# EAGLE design DotMatrixDigitalClockDisplay (EAGLE 9.6.1)
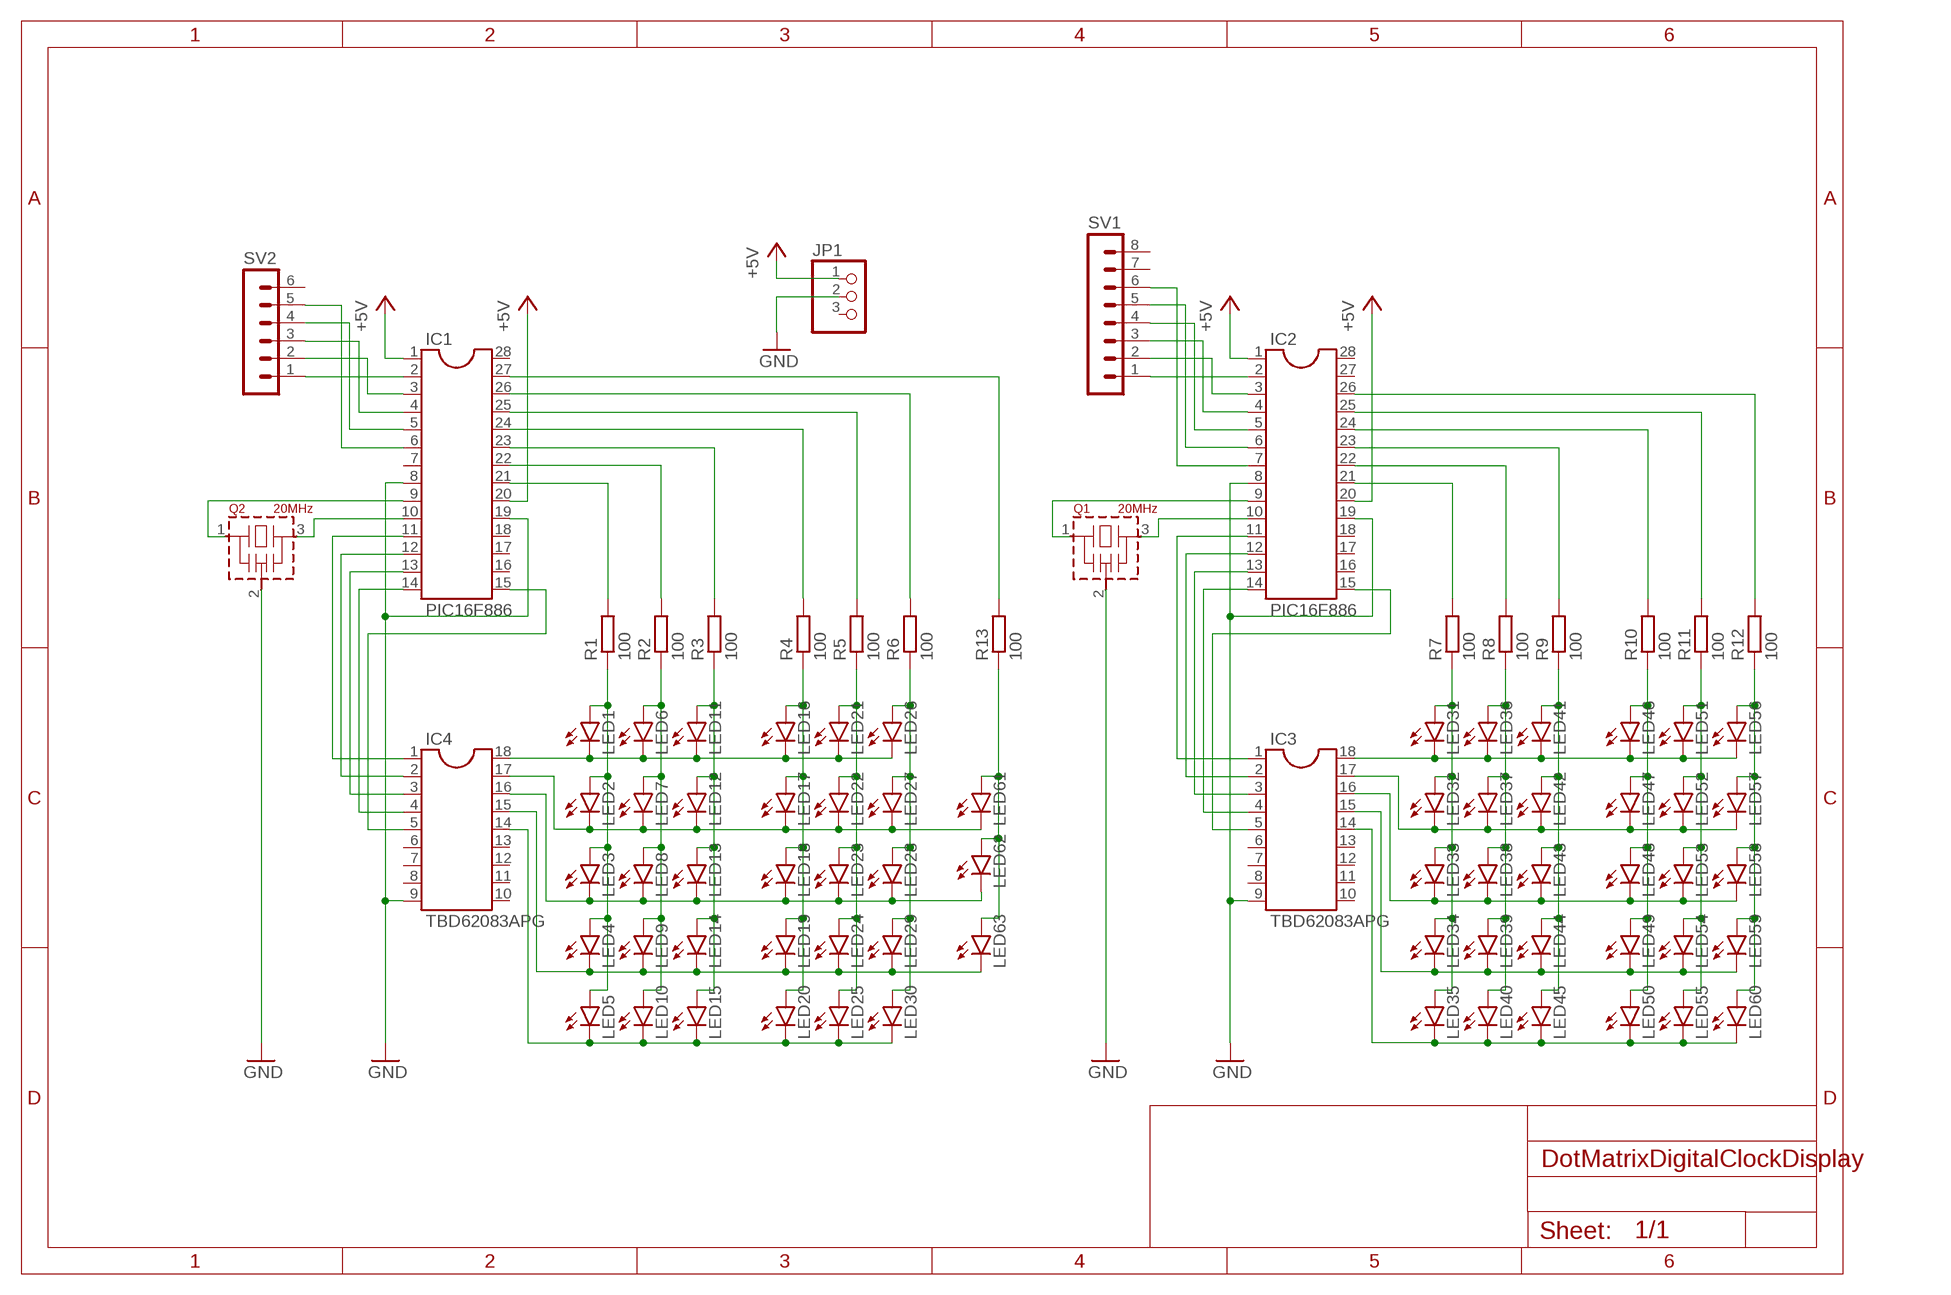
[diagram p0: schematic, sheet 1]

## Parts
IC1  PIC16F886  DIL28-3  [DIL28-3]
IC2  PIC16F886  DIL28-3  [DIL28-3]
IC3  TBD62083APG  DIL18  [DIL18]
IC4  TBD62083APG  DIL18  [DIL18]
JP1  PINHD-1X3  [1X03]
LED1  LED5MM  [LED5MM]
LED2  LED5MM  [LED5MM]
LED3  LED5MM  [LED5MM]
LED4  LED5MM  [LED5MM]
LED5  LED5MM  [LED5MM]
LED6  LED5MM  [LED5MM]
LED7  LED5MM  [LED5MM]
LED8  LED5MM  [LED5MM]
LED9  LED5MM  [LED5MM]
LED10  LED5MM  [LED5MM]
LED11  LED5MM  [LED5MM]
LED12  LED5MM  [LED5MM]
LED13  LED5MM  [LED5MM]
LED14  LED5MM  [LED5MM]
LED15  LED5MM  [LED5MM]
LED16  LED5MM  [LED5MM]
LED17  LED5MM  [LED5MM]
LED18  LED5MM  [LED5MM]
LED19  LED5MM  [LED5MM]
LED20  LED5MM  [LED5MM]
LED21  LED5MM  [LED5MM]
LED22  LED5MM  [LED5MM]
LED23  LED5MM  [LED5MM]
LED24  LED5MM  [LED5MM]
LED25  LED5MM  [LED5MM]
LED26  LED5MM  [LED5MM]
LED27  LED5MM  [LED5MM]
LED28  LED5MM  [LED5MM]
LED29  LED5MM  [LED5MM]
LED30  LED5MM  [LED5MM]
LED31  LED5MM  [LED5MM]
LED32  LED5MM  [LED5MM]
LED33  LED5MM  [LED5MM]
LED34  LED5MM  [LED5MM]
LED35  LED5MM  [LED5MM]
LED36  LED5MM  [LED5MM]
LED37  LED5MM  [LED5MM]
LED38  LED5MM  [LED5MM]
LED39  LED5MM  [LED5MM]
LED40  LED5MM  [LED5MM]
LED41  LED5MM  [LED5MM]
LED42  LED5MM  [LED5MM]
LED43  LED5MM  [LED5MM]
LED44  LED5MM  [LED5MM]
LED45  LED5MM  [LED5MM]
LED46  LED5MM  [LED5MM]
LED47  LED5MM  [LED5MM]
LED48  LED5MM  [LED5MM]
LED49  LED5MM  [LED5MM]
LED50  LED5MM  [LED5MM]
LED51  LED5MM  [LED5MM]
LED52  LED5MM  [LED5MM]
LED53  LED5MM  [LED5MM]
LED54  LED5MM  [LED5MM]
LED55  LED5MM  [LED5MM]
LED56  LED5MM  [LED5MM]
LED57  LED5MM  [LED5MM]
LED58  LED5MM  [LED5MM]
LED59  LED5MM  [LED5MM]
LED60  LED5MM  [LED5MM]
LED61  LED5MM  [LED5MM]
LED62  LED5MM  [LED5MM]
LED63  LED5MM  [LED5MM]
Q1  20MHz  CSTLS_X  [CSTLS_X]
Q2  20MHz  CSTLS_X  [CSTLS_X]
R1  100  R-EU_0207/7  [0207/7]
R2  100  R-EU_0207/7  [0207/7]
R3  100  R-EU_0207/7  [0207/7]
R4  100  R-EU_0207/7  [0207/7]
R5  100  R-EU_0207/7  [0207/7]
R6  100  R-EU_0207/7  [0207/7]
R7  100  R-EU_0207/7  [0207/7]
R8  100  R-EU_0207/7  [0207/7]
R9  100  R-EU_0207/7  [0207/7]
R10  100  R-EU_0207/7  [0207/7]
R11  100  R-EU_0207/7  [0207/7]
R12  100  R-EU_0207/7  [0207/7]
R13  100  R-EU_0207/7  [0207/7]
SV1  MA08-1  [MA08-1]
SV2  MA06-1  [MA06-1]

## Nets
+5V: IC1.1 IC1.20 IC2.1 IC2.20 JP1.1
GND: IC1.8 IC1.19 IC2.8 IC2.19 IC3.9 IC4.9 JP1.2 Q1.2(VSS) Q2.2(VSS)
N$1: LED1.A LED2.A LED3.A LED4.A LED5.A R1.1
N$2: LED6.A LED7.A LED8.A LED9.A LED10.A R2.1
N$3: LED11.A LED12.A LED13.A LED14.A LED15.A R3.1
N$4: LED16.A LED17.A LED18.A LED19.A LED20.A R4.1
N$5: LED21.A LED22.A LED23.A LED24.A LED25.A R5.1
N$6: LED26.A LED27.A LED28.A LED29.A LED30.A R6.1
N$7: LED31.A LED32.A LED33.A LED34.A LED35.A R7.1
N$8: LED36.A LED37.A LED38.A LED39.A LED40.A R8.1
N$9: LED41.A LED42.A LED43.A LED44.A LED45.A R9.1
N$10: LED46.A LED47.A LED48.A LED49.A LED50.A R10.1
N$11: LED51.A LED52.A LED53.A LED54.A LED55.A R11.1
N$12: LED56.A LED57.A LED58.A LED59.A LED60.A R12.1
N$13: LED61.A LED62.A LED63.A R13.1
N$14: IC4.18 LED1.K(C) LED6.K(C) LED11.K(C) LED16.K(C) LED21.K(C) LED26.K(C)
N$15: IC4.17 LED2.K(C) LED7.K(C) LED12.K(C) LED17.K(C) LED22.K(C) LED27.K(C) LED61.K(C)
N$16: IC4.16 LED3.K(C) LED8.K(C) LED13.K(C) LED18.K(C) LED23.K(C) LED28.K(C) LED62.K(C)
N$17: IC4.15 LED4.K(C) LED9.K(C) LED14.K(C) LED19.K(C) LED24.K(C) LED29.K(C) LED63.K(C)
N$18: IC4.14 LED5.K(C) LED10.K(C) LED15.K(C) LED20.K(C) LED25.K(C) LED30.K(C)
N$19: IC3.18 LED31.K(C) LED36.K(C) LED41.K(C) LED46.K(C) LED51.K(C) LED56.K(C)
N$20: IC3.17 LED32.K(C) LED37.K(C) LED42.K(C) LED47.K(C) LED52.K(C) LED57.K(C)
N$21: IC3.16 LED33.K(C) LED38.K(C) LED43.K(C) LED48.K(C) LED53.K(C) LED58.K(C)
N$22: IC3.15 LED34.K(C) LED39.K(C) LED44.K(C) LED49.K(C) LED54.K(C) LED59.K(C)
N$23: IC3.14 LED35.K(C) LED40.K(C) LED45.K(C) LED50.K(C) LED55.K(C) LED60.K(C)
N$24: IC2.14 IC3.4
N$25: IC2.13 IC3.3
N$26: IC2.12 IC3.2
N$27: IC2.11 IC3.1
N$28: IC2.9 Q1.1
N$29: IC2.21 R7.2
N$30: IC2.22 R8.2
N$31: IC2.23 R9.2
N$32: IC2.24 R10.2
N$33: IC2.25 R11.2
N$34: IC2.26 R12.2
N$35: IC2.10 Q1.3
N$36: IC2.15 IC3.5
N$37: IC1.14 IC4.4
N$38: IC1.15 IC4.5
N$39: IC1.13 IC4.3
N$40: IC1.12 IC4.2
N$41: IC1.11 IC4.1
N$42: IC1.21 R1.2
N$43: IC1.22 R2.2
N$44: IC1.23 R3.2
N$45: IC1.24 R4.2
N$46: IC1.25 R5.2
N$47: IC1.26 R6.2
N$48: IC1.27 R13.2
N$49: IC1.10 Q2.3
N$50: IC1.9 Q2.1
N$51: IC1.2 SV2.1
N$52: IC1.3 SV2.2
N$53: IC1.4 SV2.3
N$54: IC1.5 SV2.4
N$55: IC1.6 SV2.5
N$56: IC2.2 SV1.1
N$57: IC2.3 SV1.2
N$58: IC2.4 SV1.3
N$59: IC2.5 SV1.4
N$60: IC2.6 SV1.5
N$61: IC2.7 SV1.6
Unconnected: IC1.7 IC1.16 IC1.17 IC1.18 IC1.28 IC2.16 IC2.17 IC2.18 IC2.27 IC2.28 IC3.6 IC3.7 IC3.8 IC3.10 IC3.11 IC3.12 IC3.13 IC4.6 IC4.7 IC4.8 IC4.10 IC4.11 IC4.12 IC4.13 JP1.3 SV1.7 SV1.8 SV2.6

## Library data of the parts
IC1 IC2 = ic-package:DIL28: Dual In Line
IC3 IC4 = ic-package:DIL18: Dual In Line / Socket
JP1 = pinhead:PINHD-1X3: PIN HEADER
LED1-LED63 = led:LED: LED OSRAM: - CHIPLED LG R971, LG N971, LY N971, LG Q971, LY Q971, LO R971, LY R971 LH N974, LH R974 LS Q976, LO Q976, LY Q976 LO Q996 - Hyper CHIPLED LW Q18S LB Q993, LB Q99A, LB R99A - SideLED LS A670, LO A670, LY A670, LG A670, LP A670 LB A673, LV A673, LT A673, LW A673 LH A674 LY A675 LS A676, LA A676, LO A676, LY A676, LW A676 LS A679, LY A679, LG A679 - Hyper Micro SIDELED® LS Y876, LA Y876, LO Y876, LY Y876 LT Y87S - SmartLED LW L88C, LW L88S LB L89C, LB L89S, LG L890 LS L89K, LO L89K, LY L89K LS L896, LA L896, LO L896, LY L896 - TOPLED LS T670, LO T670, LY T670, LG T670, LP T670 LSG T670, LSP T670, LSY T670, LOP T670, LYG T670 LG T671, LOG T671, LSG T671 LB T673, LV T673, LT T673, LW T673 LH T674 LS T676, LA T676, LO T676, LY T676, LB T676, LH T676, LSB T676, LW T676 LB T67C, LV T67C, LT T67C, LS T67K, LO T67K, LY T67K, LW E67C LS E67B, LA E67B, LO E67B, LY E67B, LB E67C, LV E67C, LT E67C LW T67C LS T679, LY T679, LG T679 LS T770, LO T770, LY T770, LG T770, LP T770 LB T773, LV T773, LT T773, LW T773 LH T774 LS E675, LA E675, LY E675, LS T675 LS T776, LA T776, LO T776, LY T776, LB T776 LHGB T686 LT T68C, LB T68C - Hyper Mini TOPLED® LB M676 - Mini TOPLED Santana® LG M470 LS M47K, LO M47K, LY M47K Source: http://www.osram.convergy.de LUXEON: - LUMILED® LXK2-PW12-R00, LXK2-PW12-S00, LXK2-PW14-U00, LXK2-PW14-V00 LXK2-PM12-R00, LXK2-PM12-S00, LXK2-PM14-U00 LXK2-PE12-Q00, LXK2-PE12-R00, LXK2-PE12-S00, LXK2-PE14-T00, LXK2-PE14-U00 LXK2-PB12-K00, LXK2-PB12-L00, LXK2-PB12-M00, LXK2-PB14-N00, LXK2-PB14-P00, LXK2-PB14-Q00 LXK2-PR12-L00, LXK2-PR12-M00, LXK2-PR14-Q00, LXK2-PR14-R00 LXK2-PD12-Q00, LXK2-PD12-R00, LXK2-PD12-S00 LXK2-PH12-R00, LXK2-PH12-S00 LXK2-PL12-P00, LXK2-PL12-Q00, LXK2-PL12-R00 Source: www.luxeon.com KINGBRIGHT: KA-3528ASYC Source: www.kingbright.com
Q1 Q2 = murata-resonators:CSTLS_X: Ceramic resonator 16.00 to 70.00 MHz
R1-R13 = rcl:R-EU_: RESISTOR, European symbol; SPICEPREFIX: R
SV1 = con-lstb:MA08-1: PIN HEADER; OC_FARNELL: unknown; OC_NEWARK: unknown
SV2 = con-lstb:MA06-1: PIN HEADER; OC_FARNELL: unknown; OC_NEWARK: unknown

## Board
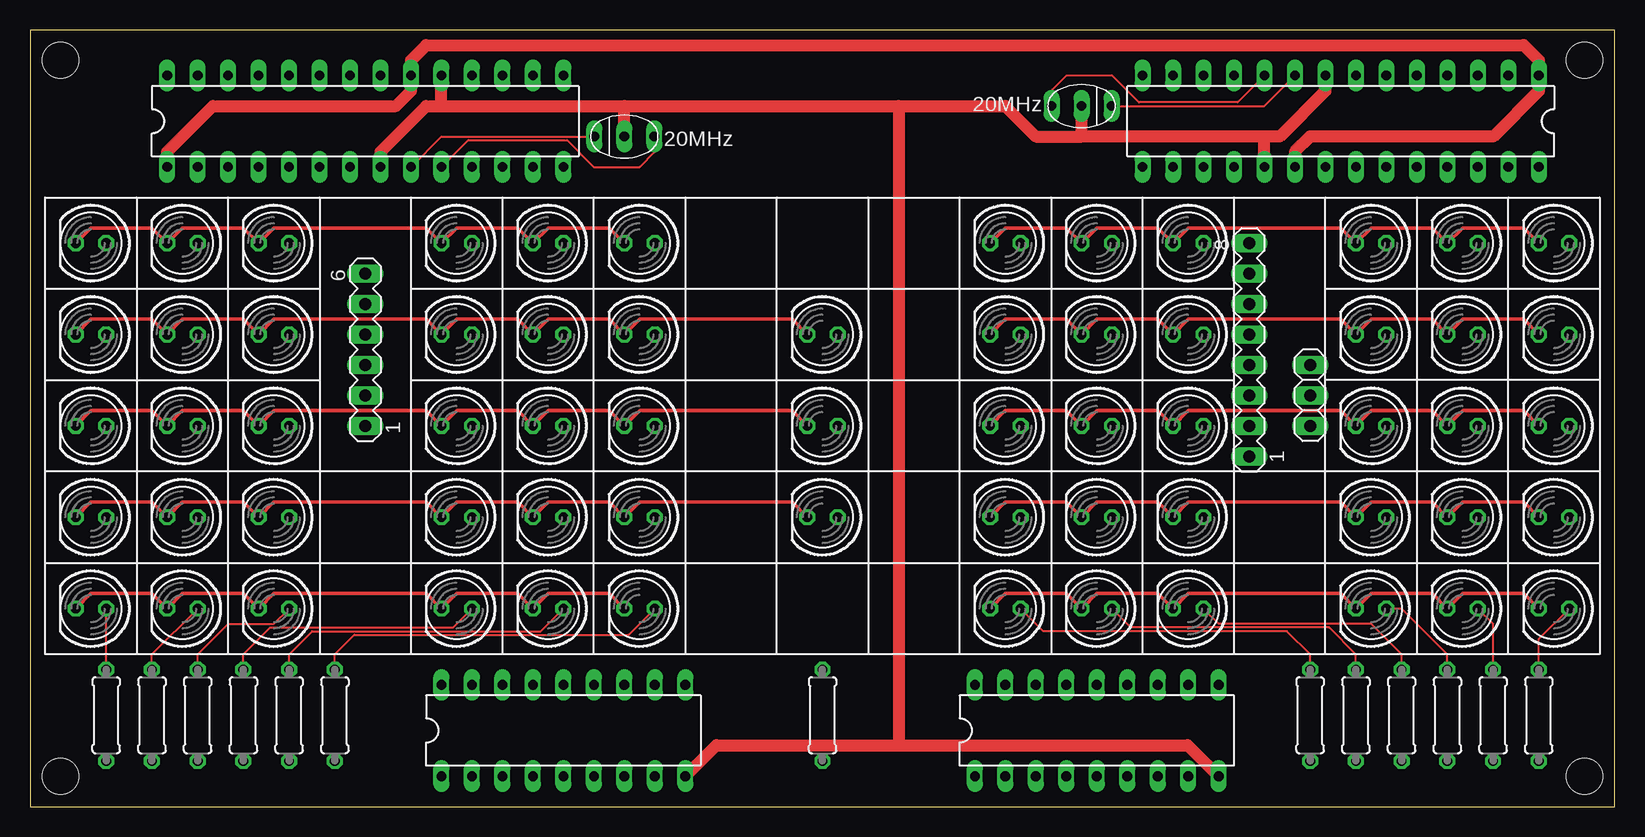
[diagram p1: board, top side]
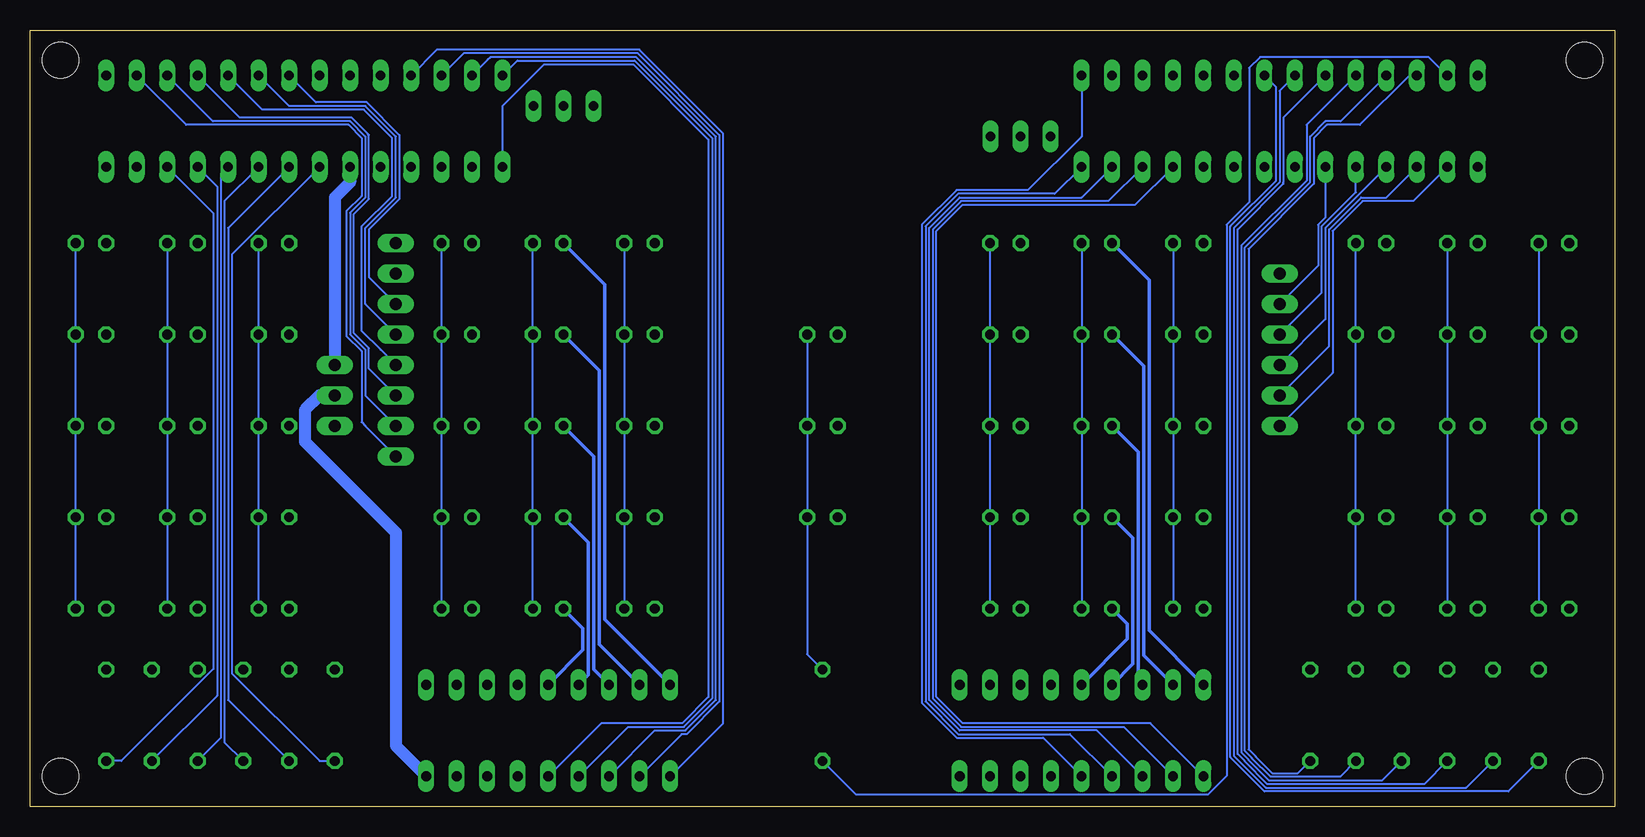
[diagram p2: board, bottom side, seen from below]

Size 132.08 x 64.76 mm. Coordinates in mm from the lower left corner, seen from the top.
Outline: 0,0 132.08,0 132.08,64.76 0,64.76 0,0
Copper layers (1*16): Top 0.035mm / dielectric 1.5mm / Bottom 0.035mm
Design rules "SeeedStudio_2layer_DRU_no_angle_20140221": minimum track width 6mil, minimum drill 12mil, track to track 6mil, track to pad 6mil, pad to pad 6mil, via to via 6mil, smd to smd 0mil, copper to edge 10mil, drill to drill 10mil, minimum pad ring 10mil, minimum via ring 6mil, stop-mask expansion 2mil, vias tented up to drill 100mil, thermal gap 10mil
Holes 3 mm at 2.54,2.54 129.54,2.54 2.54,62.23 129.54,62.23

### Footprints (pad centres in the part's own frame; a part is rotated, then mirrored left to right if it is on the bottom)
DIL28-3 = drill 0.813 long: 1 -16.51,-3.81; 2 -13.97,-3.81; 3 -11.43,-3.81; 4 -8.89,-3.81; 5 -6.35,-3.81; 6 -3.81,-3.81; 7 -1.27,-3.81; 8 1.27,-3.81; 9 3.81,-3.81; 10 6.35,-3.81; 11 8.89,-3.81; 12 11.43,-3.81; 13 13.97,-3.81; 14 16.51,-3.81; 15 16.51,3.81; 16 13.97,3.81; 17 11.43,3.81; 18 8.89,3.81; 19 6.35,3.81; 20 3.81,3.81; 21 1.27,3.81; 22 -1.27,3.81; 23 -3.81,3.81; 24 -6.35,3.81; 25 -8.89,3.81; 26 -11.43,3.81; 27 -13.97,3.81; 28 -16.51,3.81
DIL18 = drill 0.813 long: 1 -10.16,-3.81; 2 -7.62,-3.81; 3 -5.08,-3.81; 4 -2.54,-3.81; 5 0,-3.81; 6 2.54,-3.81; 7 5.08,-3.81; 8 7.62,-3.81; 9 10.16,-3.81; 10 10.16,3.81; 11 7.62,3.81; 12 5.08,3.81; 13 2.54,3.81; 14 0,3.81; 15 -2.54,3.81; 16 -5.08,3.81; 17 -7.62,3.81; 18 -10.16,3.81
1X03 = drill 1.016 long: 1 -2.54,0; 2 0,0; 3 2.54,0
LED5MM = drill 0.813 octagon: A -1.27,0; K 1.27,0
CSTLS_X = drill 0.813 long: 1 -2.5,0; 2 0,0; 3 2.5,0
0207/7 = drill 0.813 octagon: 1 -3.81,0; 2 3.81,0
MA08-1 = drill 1.016 long: 1 -8.89,0; 2 -6.35,0; 3 -3.81,0; 4 -1.27,0; 5 1.27,0; 6 3.81,0; 7 6.35,0; 8 8.89,0
MA06-1 = drill 1.016 long: 1 -6.35,0; 2 -3.81,0; 3 -1.27,0; 4 1.27,0; 5 3.81,0; 6 6.35,0

### Placement (x,y rotation side)
IC1  27.94,57.15 0 top
IC2  109.22,57.15 180 top
IC3  88.9,6.35 0 top
IC4  44.45,6.35 0 top
JP1  106.68,34.29 270 top
LED1  5.08,46.99 180 top
LED2  5.08,39.37 180 top
LED3  5.08,31.75 180 top
LED4  5.08,24.13 180 top
LED5  5.08,16.51 180 top
LED6  12.7,46.99 180 top
LED7  12.7,39.37 180 top
LED8  12.7,31.75 180 top
LED9  12.7,24.13 180 top
LED10  12.7,16.51 180 top
LED11  20.32,46.99 180 top
LED12  20.32,39.37 180 top
LED13  20.32,31.75 180 top
LED14  20.32,24.13 180 top
LED15  20.32,16.51 180 top
LED16  35.56,46.99 180 top
LED17  35.56,39.37 180 top
LED18  35.56,31.75 180 top
LED19  35.56,24.13 180 top
LED20  35.56,16.51 180 top
LED21  43.18,46.99 180 top
LED22  43.18,39.37 180 top
LED23  43.18,31.75 180 top
LED24  43.18,24.13 180 top
LED25  43.18,16.51 180 top
LED26  50.8,46.99 180 top
LED27  50.8,39.37 180 top
LED28  50.8,31.75 180 top
LED29  50.8,24.13 180 top
LED30  50.8,16.51 180 top
LED31  81.28,46.99 180 top
LED32  81.28,39.37 180 top
LED33  81.28,31.75 180 top
LED34  81.28,24.13 180 top
LED35  81.28,16.51 180 top
LED36  88.9,46.99 180 top
LED37  88.9,39.37 180 top
LED38  88.9,31.75 180 top
LED39  88.9,24.13 180 top
LED40  88.9,16.51 180 top
LED41  96.52,46.99 180 top
LED42  96.52,39.37 180 top
LED43  96.52,31.75 180 top
LED44  96.52,24.13 180 top
LED45  96.52,16.51 180 top
LED46  111.76,46.99 180 top
LED47  111.76,39.37 180 top
LED48  111.76,31.75 180 top
LED49  111.76,24.13 180 top
LED50  111.76,16.51 180 top
LED51  119.38,46.99 180 top
LED52  119.38,39.37 180 top
LED53  119.38,31.75 180 top
LED54  119.38,24.13 180 top
LED55  119.38,16.51 180 top
LED56  127,46.99 180 top
LED57  127,39.37 180 top
LED58  127,31.75 180 top
LED59  127,24.13 180 top
LED60  127,16.51 180 top
LED61  66.04,39.37 180 top
LED62  66.04,31.75 180 top
LED63  66.04,24.13 180 top
Q1  87.63,58.42 180 top
Q2  49.53,55.88 0 top
R1  6.35,7.62 270 top
R2  10.16,7.62 270 top
R3  13.97,7.62 270 top
R4  17.78,7.62 270 top
R5  21.59,7.62 270 top
R6  25.4,7.62 270 top
R7  106.68,7.62 270 top
R8  110.49,7.62 270 top
R9  114.3,7.62 270 top
R10  118.11,7.62 270 top
R11  121.92,7.62 270 top
R12  125.73,7.62 270 top
R13  66.04,7.62 270 top
SV1  101.6,38.1 90 top
SV2  27.94,38.1 90 top

### Tracks (layer width: path | path; a pad name or v marks a point on that pad's centre or on a via)
+5V
  Top 1.016: IC1.1 11.43,54.61 15.24,58.42 30.48,58.42 31.75,59.69 IC1.20 31.75,62.23 33.02,63.5 124.46,63.5 125.73,62.23 IC2.1 125.73,59.69 121.92,55.88 106.68,55.88 105.41,54.61 IC2.20
  Bottom 1.016: IC2.20 105.41,52.07 106.68,50.8 JP1.1
GND
  Top 1.016: 34.29,58.42 IC1.19 | 72.39,5.13 57.2,5.13 IC4.9 | 72.39,5.13 96.47,5.13 IC3.9 | 34.29,58.42 49.53,58.42 | Q2.2 49.53,58.42 | IC2.19 102.87,55.88 | 102.87,55.88 87.63,55.88 | 87.63,55.88 Q1.2 | 49.53,58.42 72.39,58.42 | 72.39,58.42 81.28,58.42 83.82,55.88 87.63,55.88 | IC1.8 29.21,54.61 33.02,58.42 34.29,58.42 | IC2.8 107.95,59.69 104.14,55.88 102.87,55.88 | 72.39,58.42 72.39,5.13
  Bottom 1.016: JP1.2 107.95,34.29 109.17,33.07 109.17,30.43 101.6,22.86 101.6,5.08 IC3.9
N$1
  Top 0.152: R1.1 LED5.A
  Bottom 0.152: LED1.A LED2.A LED3.A LED4.A LED5.A
N$2
  Top 0.152: R2.1 10.16,12.7 LED10.A
  Bottom 0.152: LED6.A LED7.A LED8.A LED9.A LED10.A
N$3
  Top 0.152: R3.1 13.97,12.7 16.51,15.24 20.32,15.24 LED15.A
  Bottom 0.152: LED15.A LED14.A LED13.A LED12.A LED11.A
N$4
  Top 0.152: R4.1 17.78,12.7 20.02,14.94 35.26,14.94 LED20.A
  Bottom 0.152: LED16.A LED17.A LED18.A LED19.A LED20.A
N$5
  Top 0.152: R5.1 21.59,12.7 23.52,14.63 42.57,14.63 LED25.A
  Bottom 0.152: LED21.A LED22.A LED23.A LED24.A LED25.A
N$6
  Top 0.152: R6.1 25.4,12.7 27.03,14.33 49.89,14.33 LED30.A
  Bottom 0.152: LED30.A LED29.A LED28.A LED27.A LED26.A
N$7
  Top 0.152: R7.1 106.68,12.7 104.75,14.63 84.43,14.63 LED35.A
  Bottom 0.152: LED31.A LED32.A LED33.A LED34.A LED35.A
N$8
  Top 0.152: R8.1 110.49,12.7 108.25,14.94 91.75,14.94 LED40.A
  Bottom 0.152: LED40.A LED39.A LED38.A LED37.A LED36.A
N$9
  Top 0.152: R9.1 114.3,12.7 111.76,15.24 99.06,15.24 LED45.A
  Bottom 0.152: LED41.A LED42.A LED43.A LED44.A LED45.A
N$10
  Top 0.152: R10.1 118.11,12.7 114.3,16.51 LED50.A
  Bottom 0.152: LED50.A LED49.A LED48.A LED47.A LED46.A
N$11
  Top 0.152: LED55.A 121.92,15.24 R11.1
  Bottom 0.152: LED51.A LED52.A LED53.A LED54.A LED55.A
N$12
  Top 0.152: LED60.A 125.73,13.97 R12.1
  Bottom 0.152: LED60.A LED59.A LED58.A LED57.A LED56.A
N$13
  Bottom 0.152: LED61.A LED62.A LED63.A 67.31,12.7 R13.1
N$14
  Top 0.305: LED1.K 5.08,48.26 10.16,48.26 LED6.K 12.7,48.26 17.78,48.26 LED11.K 20.32,48.26 33.02,48.26 LED16.K 35.56,48.26 40.64,48.26 LED21.K 43.18,48.26 48.26,48.26 LED26.K
  Bottom 0.305: LED21.K 38.81,43.89 38.81,14.68 IC4.18
N$15
  Top 0.305: LED2.K 5.08,40.64 10.16,40.64 LED7.K 12.7,40.64 17.78,40.64 LED12.K 20.32,40.64 33.02,40.64 LED17.K 35.56,40.64 40.64,40.64 LED22.K 43.18,40.64 48.26,40.64 LED27.K 50.8,40.64 63.5,40.64 LED61.K
  Bottom 0.305: LED22.K 39.27,36.73 39.27,12.6 IC4.17
N$16
  Top 0.305: LED3.K 5.08,33.02 10.16,33.02 LED8.K 12.7,33.02 17.78,33.02 LED13.K 20.32,33.02 33.02,33.02 LED18.K 35.56,33.02 40.64,33.02 LED23.K 43.18,33.02 48.26,33.02 LED28.K 50.8,33.02 63.5,33.02 LED62.K
  Bottom 0.305: IC4.16 39.73,10.52 39.73,29.57 LED23.K
N$17
  Top 0.305: LED4.K 5.08,25.4 10.16,25.4 LED9.K 12.7,25.4 17.78,25.4 LED14.K 20.32,25.4 33.02,25.4 LED19.K 35.56,25.4 40.64,25.4 LED24.K 43.18,25.4 48.26,25.4 LED29.K 50.8,25.4 63.5,25.4 LED63.K
  Bottom 0.305: LED24.K 40.18,22.4 40.18,11.89 IC4.15
N$18
  Top 0.305: LED5.K 5.08,17.78 10.16,17.78 LED10.K 12.7,17.78 17.78,17.78 LED15.K 20.32,17.78 33.02,17.78 LED20.K 35.56,17.78 40.64,17.78 LED25.K 43.18,17.78 48.26,17.78 LED30.K
  Bottom 0.305: IC4.14 40.64,13.97 40.64,15.24 LED25.K
N$19
  Top 0.305: LED31.K 81.28,48.26 86.36,48.26 LED36.K 88.9,48.26 93.98,48.26 LED41.K 96.52,48.26 109.22,48.26 LED46.K 111.76,48.26 116.84,48.26 LED51.K 119.38,48.26 124.46,48.26 LED56.K
  Bottom 0.305: LED36.K 84.18,43.54 84.18,15.6 IC3.18
N$20
  Top 0.305: LED32.K 81.28,40.64 86.36,40.64 LED37.K 88.9,40.64 93.98,40.64 LED42.K 96.52,40.64 109.22,40.64 LED47.K 111.76,40.64 116.84,40.64 LED52.K 119.38,40.64 124.46,40.64 LED57.K
  Bottom 0.305: LED37.K 84.63,36.37 84.63,13.51 IC3.17
N$21
  Top 0.305: LED33.K 81.28,33.02 86.36,33.02 LED38.K 88.9,33.02 93.98,33.02 LED43.K 96.52,33.02 109.22,33.02 LED48.K 111.76,33.02 116.84,33.02 LED53.K 119.38,33.02 124.46,33.02 LED58.K
  Bottom 0.305: IC3.16 85.09,11.43 85.09,29.21 LED38.K
N$22
  Top 0.305: LED34.K 81.28,25.4 86.36,25.4 LED39.K 88.9,25.4 93.98,25.4 LED44.K 96.52,25.4 109.22,25.4 LED49.K 111.76,25.4 116.84,25.4 LED54.K 119.38,25.4 124.46,25.4 LED59.K
  Bottom 0.305: IC3.15 85.55,10.97 85.55,22.05 LED39.K
N$23
  Top 0.305: LED35.K 81.28,17.78 86.36,17.78 LED40.K 88.9,17.78 93.98,17.78 LED45.K 96.52,17.78 109.22,17.78 LED50.K 111.76,17.78 116.84,17.78 LED55.K 119.38,17.78 124.46,17.78 LED60.K
  Bottom 0.305: LED40.K 86,14.88 86,13.06 IC3.14
N$24
  Bottom 0.152: IC3.4 82.25,6.66 77.6,6.66 75.23,9.02 75.23,55.75 81.69,62.2 91.47,62.2 IC2.14
N$25
  Bottom 0.152: IC3.3 80.01,6.35 77.47,6.35 74.93,8.89 74.93,55.88 81.56,62.51 93.7,62.51 93.98,62.23 IC2.13
N$26
  Bottom 0.152: IC2.12 95.94,62.81 81.43,62.81 74.62,56.01 74.62,8.76 77.34,6.04 77.78,6.04 IC3.2
N$27
  Bottom 0.152: IC2.11 98.17,63.12 81.31,63.12 74.32,56.13 74.32,6.96 IC3.1
N$28
  Top 0.152: Q1.1 102.87,58.42 IC2.9
N$29
  Bottom 0.152: R7.2 107.95,3.81 115.27,11.12 115.27,46.02 IC2.21
N$30
  Bottom 0.152: IC2.22 115.57,48.26 115.57,8.89 R8.2
N$31
  Bottom 0.152: R9.2 115.88,5.38 115.88,50.49 IC2.23
N$32
  Bottom 0.152: IC2.24 116.18,52.73 116.18,5.74 R10.2
N$33
  Bottom 0.152: R11.2 116.48,9.25 116.48,51.71 IC2.25
N$34
  Bottom 0.152: R12.2 124.46,3.81 116.79,11.48 116.79,49.48 IC2.26
N$35
  Top 0.152: Q1.3 85.09,58.46 85.09,59.69 86.36,60.96 90.17,60.96 92.41,58.73 100.64,58.73 IC2.10
N$36
  Bottom 0.152: IC3.5 84.45,6.99 77.7,6.99 75.54,9.14 75.54,55.63 81.81,61.9 89.23,61.9 92.71,58.42 IC2.15
N$37
  Bottom 0.152: IC4.4 45.41,6.04 54.74,6.04 57.45,8.76 57.45,48.39 54.74,51.1 46.69,51.1 IC1.14
N$38
  Bottom 0.152: IC1.15 44.45,55.88 48.92,51.41 54.86,51.41 57.76,48.51 57.76,8.64 54.86,5.74 47.65,5.74 IC4.5
N$39
  Bottom 0.152: IC4.3 43.18,6.35 54.61,6.35 57.15,8.89 57.15,48.26 54.61,50.8 44.45,50.8 IC1.13
N$40
  Bottom 0.152: IC1.12 42.22,50.49 54.48,50.49 56.84,48.13 56.84,9.02 54.48,6.66 40.95,6.66 IC4.2
N$41
  Bottom 0.152: IC1.11 39.98,50.19 54.36,50.19 56.54,48.01 56.54,9.14 54.36,6.96 38.71,6.96 IC4.1
N$42
  Bottom 0.152: IC1.21 28.25,59.99 28.25,52.2 32.05,48.39 32.05,4.12 29.21,1.27 8.89,1.27 R1.2
N$43
  Bottom 0.152: IC1.22 27.94,59.69 27.94,52.07 31.75,48.26 31.75,4.24 29.08,1.57 12.39,1.57 R2.2
N$44
  Bottom 0.152: IC1.23 27.64,57.45 27.64,52.07 27.64,51.94 31.45,48.13 31.45,4.39 30.86,3.81 30.86,3.78 28.96,1.88 15.9,1.88 R3.2
N$45
  Bottom 0.152: IC1.24 25.7,56.84 25.7,52.2 31.14,46.76 31.14,4.52 30.56,3.94 30.56,3.91 28.83,2.18 19.41,2.18 R4.2
N$46
  Bottom 0.152: IC1.25 22.86,57.15 24.13,57.15 25.4,55.88 25.4,52.07 30.84,46.63 30.84,4.65 30.25,4.06 30.25,4.04 28.7,2.49 22.91,2.49 R5.2
N$47
  Bottom 0.152: IC1.26 17.13,60.96 21.25,56.84 24,56.84 25.09,55.75 25.09,52.07 25.09,51.94 30.53,46.51 30.53,4.77 29.95,4.19 29.95,4.16 28.58,2.79 26.42,2.79 R6.2
N$48
  Bottom 0.152: R13.2 63.22,0.99 33.92,0.99 32.36,2.55 32.36,48.51 30.48,50.39 30.48,61.61 29.58,62.51 15.52,62.51 IC1.27
N$49
  Top 0.152: Q2.3 52.07,55.84 52.07,54.61 50.8,53.34 46.99,53.34 44.76,55.58 36.52,55.58 IC1.10
N$50
  Top 0.152: IC1.9 34.29,55.88 Q2.1
N$51
  Bottom 0.152: SV2.1 23.52,36.17 23.52,48.01 21.03,50.49 16.82,50.49 IC1.2
N$52
  Bottom 0.152: SV2.2 23.82,38.41 23.82,48.13 21.16,50.8 19.05,50.8 IC1.3
N$53
  Bottom 0.152: IC1.4 24.13,48.26 24.13,40.64 SV2.3
N$54
  Bottom 0.152: IC1.5 21.59,51.23 24.43,48.39 24.43,42.88 SV2.4
N$55
  Bottom 0.152: SV2.5 24.74,45.11 24.74,48.51 24.13,49.12 IC1.6
N$56
  Bottom 0.152: IC2.2 119.08,56.84 105.54,56.84 104.44,55.75 104.44,50.93 105.72,49.66 105.72,39.24 104.44,37.97 104.44,32.05 104.14,31.75 SV1.1
N$57
  Bottom 0.152: SV1.2 104.14,34.29 104.14,38.1 105.41,39.37 105.41,49.53 104.14,50.8 104.14,55.88 105.41,57.15 116.84,57.15 IC2.3
N$58
  Bottom 0.152: IC2.4 114.61,57.45 105.28,57.45 103.92,56.1 103.83,56.01 103.83,50.67 105.11,49.4 105.11,39.5 103.83,38.23 103.83,36.52 SV1.3
N$59
  Bottom 0.152: IC2.5 112.72,58.12 104.27,58.12 101.91,55.75 101.91,50.93 104.44,48.39 104.44,39.67 102.87,38.1 SV1.4
N$60
  Bottom 0.152: IC2.6 110.49,58.42 104.14,58.42 101.6,55.88 101.6,50.8 104.14,48.26 104.14,41.91 SV1.5
N$61
  Bottom 0.152: IC2.7 108.25,58.73 104.01,58.73 101.3,56.01 101.3,50.67 103.83,48.13 103.83,44.15 SV1.6